# Altium schematic sheet FPGA.SchDoc
size A3; SheetNumber: 1; SheetTotal: 1
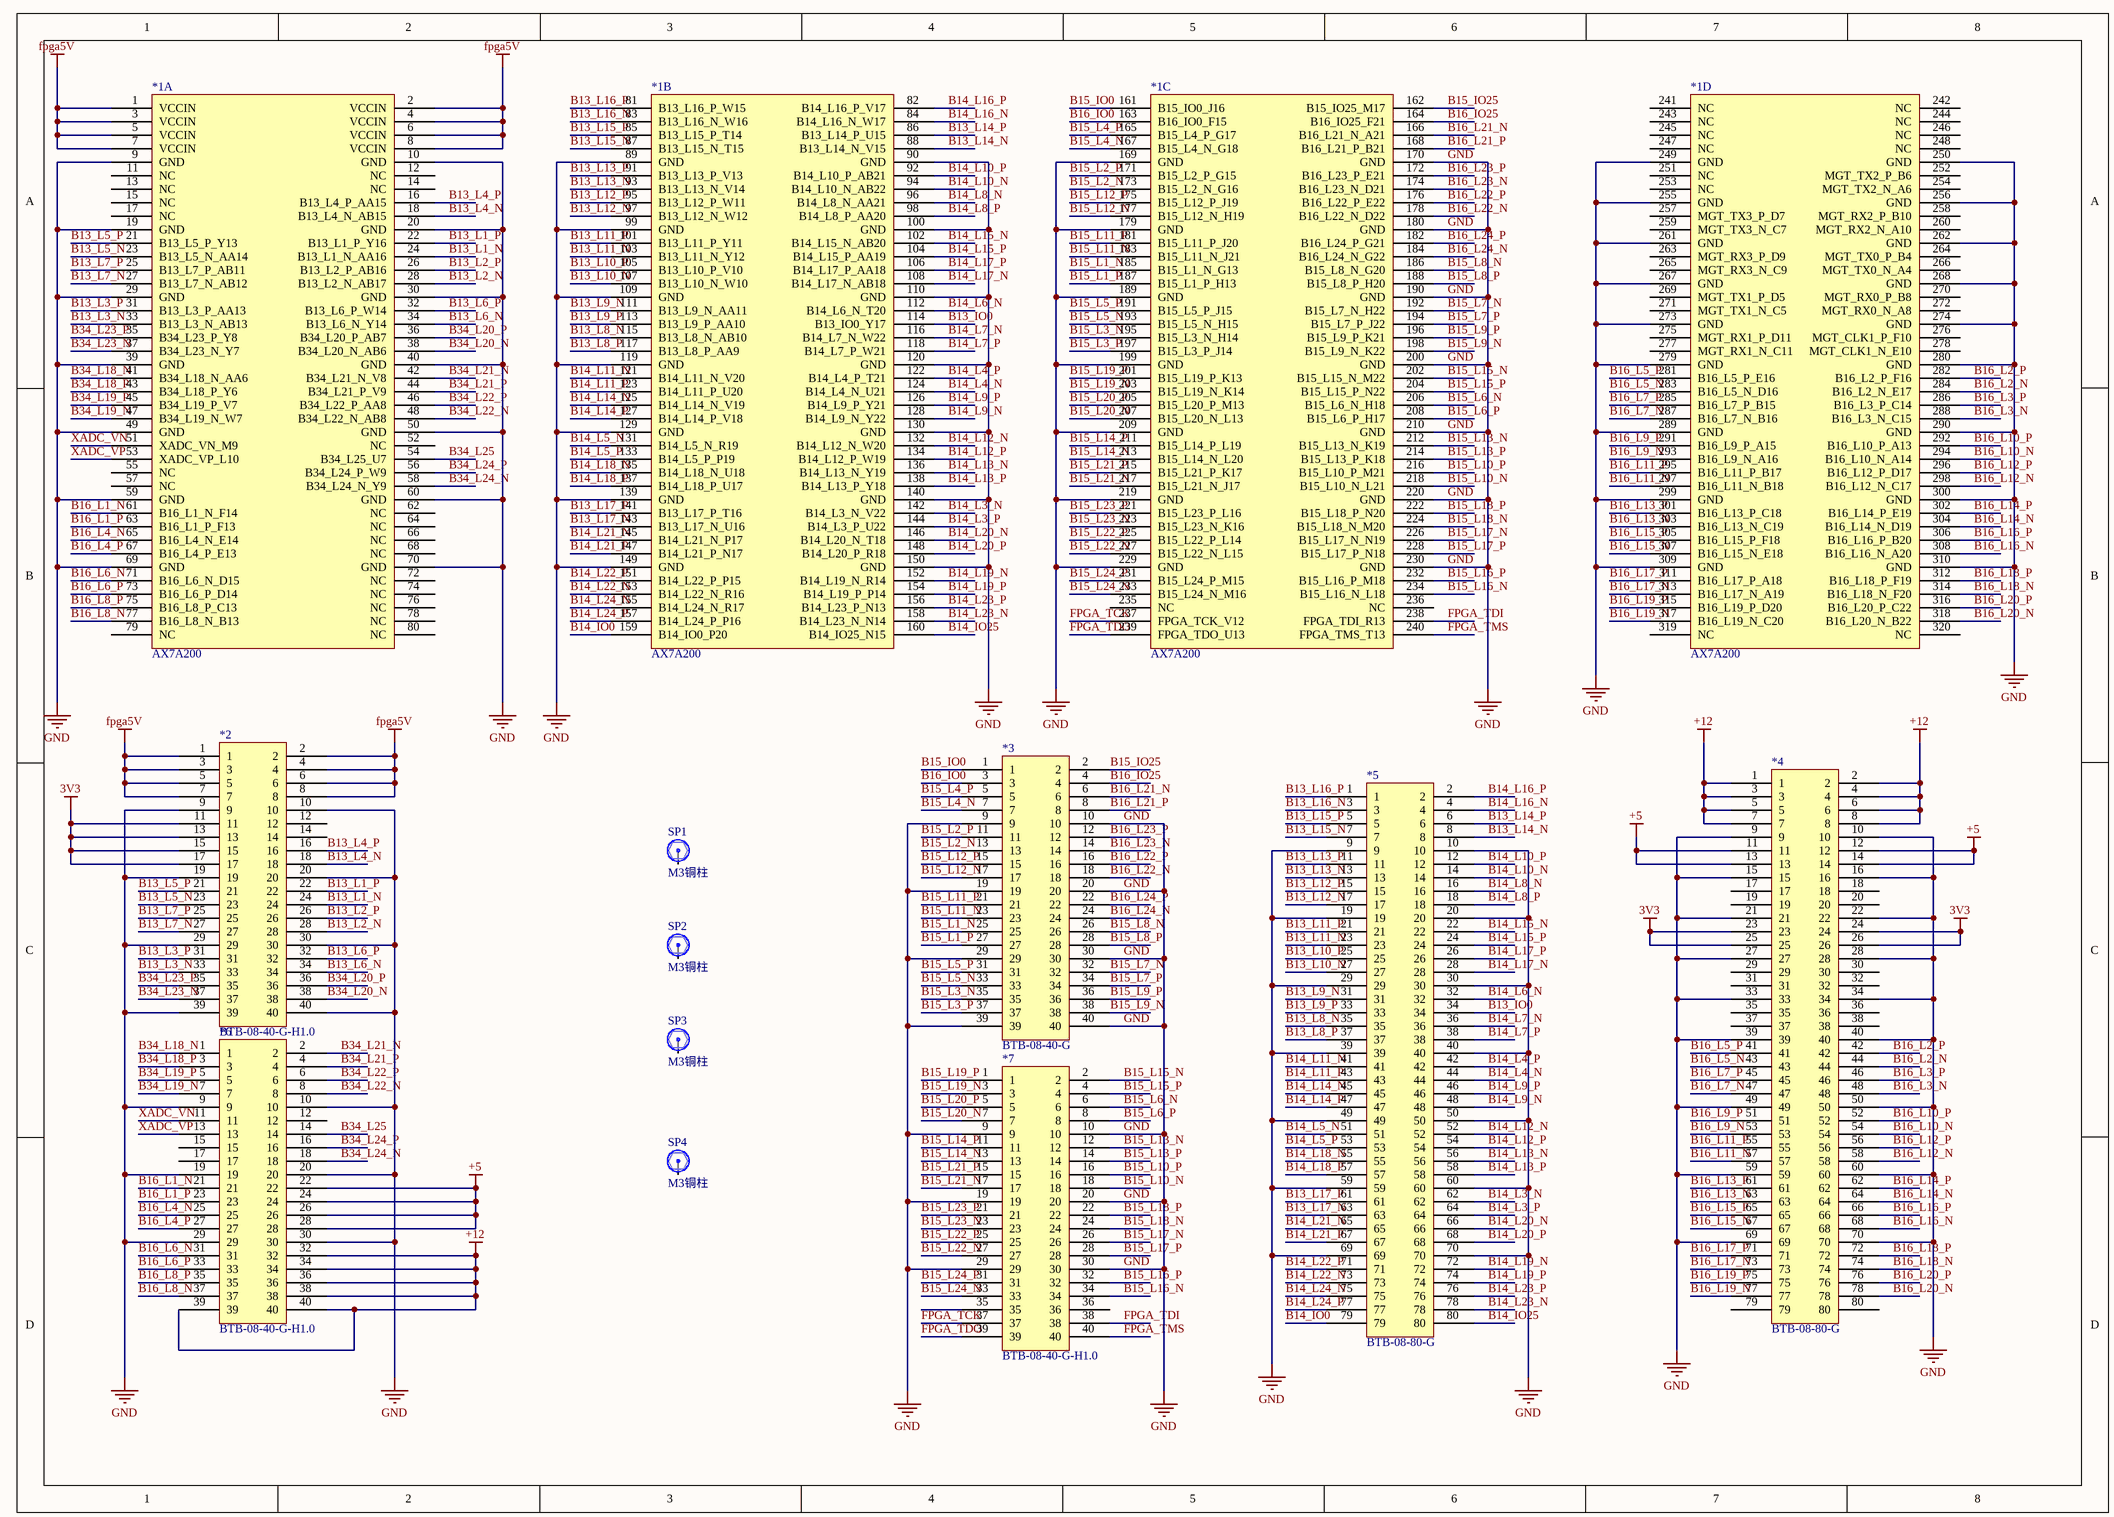
[diagram p0: FPGA.SchDoc]

## Parts
*1  AX7A200  [AX7A200]  (parts A,B,C,D of 4)
*2  BTB-08-40-G-H1.0  [BTB-08-40-G-H1.0]
*3  BTB-08-40-G  [BTB-08-40-G]
*4  BTB-08-80-G  [BTB-08-80-M]
*5  BTB-08-80-G  [BTB-08-80-M]
*6  BTB-08-40-G-H1.0  [BTB-08-40-G-H1.0]
*7  BTB-08-40-G-H1.0  [BTB-08-40-G-H1.0]
SP1  M3铜柱  [M3x10_N]
SP2  M3铜柱  [M3x10_N]
SP3  M3铜柱  [M3x10_N]
SP4  M3铜柱  [M3x10_N]

## Nets
3V3: *2.11 *2.13 *2.15 *2.17 *4.23 *4.24 *4.25 *4.26
+5: *4.11 *4.12 *4.13 *4.14 *6.22 *6.24 *6.26 *6.28
+12: *4.1 *4.2 *4.3 *4.4 *4.5 *4.6 *4.7 *4.8 *6.32 *6.34 *6.36 *6.38 *6.39 *6.40
fpga5V: *1.1(VCCIN) *1.2(VCCIN) *1.3(VCCIN) *1.4(VCCIN) *1.5(VCCIN) *1.6(VCCIN) *1.7(VCCIN) *1.8(VCCIN) *2.1 *2.2 *2.3 *2.4 *2.5 *2.6 *2.7 *2.8
GND: *1.9(GND) *1.10(GND) *1.19(GND) *1.20(GND) *1.29(GND) *1.30(GND) *1.39(GND) *1.40(GND) *1.49(GND) *1.50(GND) *1.59(GND) *1.60(GND) *1.69(GND) *1.70(GND) *1.89(GND) *1.90(GND) *1.99(GND) *1.100(GND) *1.109(GND) *1.110(GND) *1.119(GND) *1.120(GND) *1.129(GND) *1.130(GND) *1.139(GND) *1.140(GND) *1.149(GND) *1.150(GND) *1.169(GND) *1.170(GND) *1.179(GND) *1.180(GND) *1.189(GND) *1.190(GND) *1.199(GND) *1.200(GND) *1.209(GND) *1.210(GND) *1.219(GND) *1.220(GND) *1.229(GND) *1.230(GND) *1.249(GND) *1.250(GND) *1.255(GND) *1.256(GND) *1.261(GND) *1.262(GND) *1.267(GND) *1.268(GND) *1.273(GND) *1.274(GND) *1.279(GND) *1.280(GND) *1.289(GND) *1.290(GND) *1.299(GND) *1.300(GND) *1.309(GND) *1.310(GND) *2.9 *2.10 *2.19 *2.20 *2.29 *2.30 *2.39 *2.40 *3.9 *3.10 *3.19 *3.20 *3.29 *3.30 *3.39 *3.40 *4.9 *4.10 *4.15 *4.16 *4.21 *4.22 *4.27 *4.28 *4.33 *4.34 *4.39 *4.40 *4.49 *4.50 *4.59 *4.60 *4.69 *4.70 *5.9 *5.10 *5.19 *5.20 *5.29 *5.30 *5.39 *5.40 *5.49 *5.50 *5.59 *5.60 *5.69 *5.70 *6.9 *6.10 *6.19 *6.20 *6.29 *6.30 *7.9 *7.10 *7.19 *7.20 *7.29 *7.30
B13_IO0: *1.114(B13_IO0_Y17) *5.34
B13_L1_N: *1.24(B13_L1_N_AA16) *2.24
B13_L1_P: *1.22(B13_L1_P_Y16) *2.22
B13_L2_N: *1.28(B13_L2_N_AB17) *2.28
B13_L2_P: *1.26(B13_L2_P_AB16) *2.26
B13_L3_N: *1.33(B13_L3_N_AB13) *2.33
B13_L3_P: *1.31(B13_L3_P_AA13) *2.31
B13_L4_N: *1.18(B13_L4_N_AB15) *2.18
B13_L4_P: *1.16(B13_L4_P_AA15) *2.16
B13_L5_N: *1.23(B13_L5_N_AA14) *2.23
B13_L5_P: *1.21(B13_L5_P_Y13) *2.21
B13_L6_N: *1.34(B13_L6_N_Y14) *2.34
B13_L6_P: *1.32(B13_L6_P_W14) *2.32
B13_L7_N: *1.27(B13_L7_N_AB12) *2.27
B13_L7_P: *1.25(B13_L7_P_AB11) *2.25
B13_L8_N: *1.115(B13_L8_N_AB10) *5.35
B13_L8_P: *1.117(B13_L8_P_AA9) *5.37
B13_L9_N: *1.111(B13_L9_N_AA11) *5.31
B13_L9_P: *1.113(B13_L9_P_AA10) *5.33
B13_L10_N: *1.107(B13_L10_N_W10) *5.27
B13_L10_P: *1.105(B13_L10_P_V10) *5.25
B13_L11_N: *1.103(B13_L11_N_Y12) *5.23
B13_L11_P: *1.101(B13_L11_P_Y11) *5.21
B13_L12_N: *1.97(B13_L12_N_W12) *5.17
B13_L12_P: *1.95(B13_L12_P_W11) *5.15
B13_L13_N: *1.93(B13_L13_N_V14) *5.13
B13_L13_P: *1.91(B13_L13_P_V13) *5.11
B13_L14_N: *1.88(B13_L14_N_V15) *5.8
B13_L14_P: *1.86(B13_L14_P_U15) *5.6
B13_L15_N: *1.87(B13_L15_N_T15) *5.7
B13_L15_P: *1.85(B13_L15_P_T14) *5.5
B13_L16_N: *1.83(B13_L16_N_W16) *5.3
B13_L16_P: *1.81(B13_L16_P_W15) *5.1
B13_L17_N: *1.143(B13_L17_N_U16) *5.63
B13_L17_P: *1.141(B13_L17_P_T16) *5.61
B14_IO0: *1.159(B14_IO0_P20) *5.79
B14_IO25: *1.160(B14_IO25_N15) *5.80
B14_L3_N: *1.142(B14_L3_N_V22) *5.62
B14_L3_P: *1.144(B14_L3_P_U22) *5.64
B14_L4_N: *1.124(B14_L4_N_U21) *5.44
B14_L4_P: *1.122(B14_L4_P_T21) *5.42
B14_L5_N: *1.131(B14_L5_N_R19) *5.51
B14_L5_P: *1.133(B14_L5_P_P19) *5.53
B14_L6_N: *1.112(B14_L6_N_T20) *5.32
B14_L7_N: *1.116(B14_L7_N_W22) *5.36
B14_L7_P: *1.118(B14_L7_P_W21) *5.38
B14_L8_N: *1.96(B14_L8_N_AA21) *5.16
B14_L8_P: *1.98(B14_L8_P_AA20) *5.18
B14_L9_N: *1.128(B14_L9_N_Y22) *5.48
B14_L9_P: *1.126(B14_L9_P_Y21) *5.46
B14_L10_N: *1.94(B14_L10_N_AB22) *5.14
B14_L10_P: *1.92(B14_L10_P_AB21) *5.12
B14_L11_N: *1.121(B14_L11_N_V20) *5.41
B14_L11_P: *1.123(B14_L11_P_U20) *5.43
B14_L12_N: *1.132(B14_L12_N_W20) *5.52
B14_L12_P: *1.134(B14_L12_P_W19) *5.54
B14_L13_N: *1.136(B14_L13_N_Y19) *5.56
B14_L13_P: *1.138(B14_L13_P_Y18) *5.58
B14_L14_N: *1.125(B14_L14_N_V19) *5.45
B14_L14_P: *1.127(B14_L14_P_V18) *5.47
B14_L15_N: *1.102(B14_L15_N_AB20) *5.22
B14_L15_P: *1.104(B14_L15_P_AA19) *5.24
B14_L16_N: *1.84(B14_L16_N_W17) *5.4
B14_L16_P: *1.82(B14_L16_P_V17) *5.2
B14_L17_N: *1.108(B14_L17_N_AB18) *5.28
B14_L17_P: *1.106(B14_L17_P_AA18) *5.26
B14_L18_N: *1.135(B14_L18_N_U18) *5.55
B14_L18_P: *1.137(B14_L18_P_U17) *5.57
B14_L19_N: *1.152(B14_L19_N_R14) *5.72
B14_L19_P: *1.154(B14_L19_P_P14) *5.74
B14_L20_N: *1.146(B14_L20_N_T18) *5.66
B14_L20_P: *1.148(B14_L20_P_R18) *5.68
B14_L21_N: *1.145(B14_L21_N_P17) *5.65
B14_L21_P: *1.147(B14_L21_P_N17) *5.67
B14_L22_N: *1.153(B14_L22_N_R16) *5.73
B14_L22_P: *1.151(B14_L22_P_P15) *5.71
B14_L23_N: *1.158(B14_L23_N_N14) *5.78
B14_L23_P: *1.156(B14_L23_P_N13) *5.76
B14_L24_N: *1.155(B14_L24_N_R17) *5.75
B14_L24_P: *1.157(B14_L24_P_P16) *5.77
B15_IO0: *1.161(B15_IO0_J16) *3.1
B15_IO25: *1.162(B15_IO25_M17) *3.2
B15_L1_N: *1.185(B15_L1_N_G13) *3.25
B15_L1_P: *1.187(B15_L1_P_H13) *3.27
B15_L2_N: *1.173(B15_L2_N_G16) *3.13
B15_L2_P: *1.171(B15_L2_P_G15) *3.11
B15_L3_N: *1.195(B15_L3_N_H14) *3.35
B15_L3_P: *1.197(B15_L3_P_J14) *3.37
B15_L4_N: *1.167(B15_L4_N_G18) *3.7
B15_L4_P: *1.165(B15_L4_P_G17) *3.5
B15_L5_N: *1.193(B15_L5_N_H15) *3.33
B15_L5_P: *1.191(B15_L5_P_J15) *3.31
B15_L6_N: *1.206(B15_L6_N_H18) *7.6
B15_L6_P: *1.208(B15_L6_P_H17) *7.8
B15_L7_N: *1.192(B15_L7_N_H22) *3.32
B15_L7_P: *1.194(B15_L7_P_J22) *3.34
B15_L8_N: *1.186(B15_L8_N_G20) *3.26
B15_L8_P: *1.188(B15_L8_P_H20) *3.28
B15_L9_N: *1.198(B15_L9_N_K22) *3.38
B15_L9_P: *1.196(B15_L9_P_K21) *3.36
B15_L10_N: *1.218(B15_L10_N_L21) *7.18
B15_L10_P: *1.216(B15_L10_P_M21) *7.16
B15_L11_N: *1.183(B15_L11_N_J21) *3.23
B15_L11_P: *1.181(B15_L11_P_J20) *3.21
B15_L12_N: *1.177(B15_L12_N_H19) *3.17
B15_L12_P: *1.175(B15_L12_P_J19) *3.15
B15_L13_N: *1.212(B15_L13_N_K19) *7.12
B15_L13_P: *1.214(B15_L13_P_K18) *7.14
B15_L14_N: *1.213(B15_L14_N_L20) *7.13
B15_L14_P: *1.211(B15_L14_P_L19) *7.11
B15_L15_N: *1.202(B15_L15_N_M22) *7.2
B15_L15_P: *1.204(B15_L15_P_N22) *7.4
B15_L16_N: *1.234(B15_L16_N_L18) *7.34
B15_L16_P: *1.232(B15_L16_P_M18) *7.32
B15_L17_N: *1.226(B15_L17_N_N19) *7.26
B15_L17_P: *1.228(B15_L17_P_N18) *7.28
B15_L18_N: *1.224(B15_L18_N_M20) *7.24
B15_L18_P: *1.222(B15_L18_P_N20) *7.22
B15_L19_N: *1.203(B15_L19_N_K14) *7.3
B15_L19_P: *1.201(B15_L19_P_K13) *7.1
B15_L20_N: *1.207(B15_L20_N_L13) *7.7
B15_L20_P: *1.205(B15_L20_P_M13) *7.5
B15_L21_N: *1.217(B15_L21_N_J17) *7.17
B15_L21_P: *1.215(B15_L21_P_K17) *7.15
B15_L22_N: *1.227(B15_L22_N_L15) *7.27
B15_L22_P: *1.225(B15_L22_P_L14) *7.25
B15_L23_N: *1.223(B15_L23_N_K16) *7.23
B15_L23_P: *1.221(B15_L23_P_L16) *7.21
B15_L24_N: *1.233(B15_L24_N_M16) *7.33
B15_L24_P: *1.231(B15_L24_P_M15) *7.31
B16_IO0: *1.163(B16_IO0_F15) *3.3
B16_IO25: *1.164(B16_IO25_F21) *3.4
B16_L1_N: *1.61(B16_L1_N_F14) *6.21
B16_L1_P: *1.63(B16_L1_P_F13) *6.23
B16_L2_N: *1.284(B16_L2_N_E17) *4.44
B16_L2_P: *1.282(B16_L2_P_F16) *4.42
B16_L3_N: *1.288(B16_L3_N_C15) *4.48
B16_L3_P: *1.286(B16_L3_P_C14) *4.46
B16_L4_N: *1.65(B16_L4_N_E14) *6.25
B16_L4_P: *1.67(B16_L4_P_E13) *6.27
B16_L5_N: *1.283(B16_L5_N_D16) *4.43
B16_L5_P: *1.281(B16_L5_P_E16) *4.41
B16_L6_N: *1.71(B16_L6_N_D15) *6.31
B16_L6_P: *1.73(B16_L6_P_D14) *6.33
B16_L7_N: *1.287(B16_L7_N_B16) *4.47
B16_L7_P: *1.285(B16_L7_P_B15) *4.45
B16_L8_N: *1.77(B16_L8_N_B13) *6.37
B16_L8_P: *1.75(B16_L8_P_C13) *6.35
B16_L9_N: *1.293(B16_L9_N_A16) *4.53
B16_L9_P: *1.291(B16_L9_P_A15) *4.51
B16_L10_N: *1.294(B16_L10_N_A14) *4.54
B16_L10_P: *1.292(B16_L10_P_A13) *4.52
B16_L11_N: *1.297(B16_L11_N_B18) *4.57
B16_L11_P: *1.295(B16_L11_P_B17) *4.55
B16_L12_N: *1.298(B16_L12_N_C17) *4.58
B16_L12_P: *1.296(B16_L12_P_D17) *4.56
B16_L13_N: *1.303(B16_L13_N_C19) *4.63
B16_L13_P: *1.301(B16_L13_P_C18) *4.61
B16_L14_N: *1.304(B16_L14_N_D19) *4.64
B16_L14_P: *1.302(B16_L14_P_E19) *4.62
B16_L15_N: *1.307(B16_L15_N_E18) *4.67
B16_L15_P: *1.305(B16_L15_P_F18) *4.65
B16_L16_N: *1.308(B16_L16_N_A20) *4.68
B16_L16_P: *1.306(B16_L16_P_B20) *4.66
B16_L17_N: *1.313(B16_L17_N_A19) *4.73
B16_L17_P: *1.311(B16_L17_P_A18) *4.71
B16_L18_N: *1.314(B16_L18_N_F20) *4.74
B16_L18_P: *1.312(B16_L18_P_F19) *4.72
B16_L19_N: *1.317(B16_L19_N_C20) *4.77
B16_L19_P: *1.315(B16_L19_P_D20) *4.75
B16_L20_N: *1.318(B16_L20_N_B22) *4.78
B16_L20_P: *1.316(B16_L20_P_C22) *4.76
B16_L21_N: *1.166(B16_L21_N_A21) *3.6
B16_L21_P: *1.168(B16_L21_P_B21) *3.8
B16_L22_N: *1.178(B16_L22_N_D22) *3.18
B16_L22_P: *1.176(B16_L22_P_E22) *3.16
B16_L23_N: *1.174(B16_L23_N_D21) *3.14
B16_L23_P: *1.172(B16_L23_P_E21) *3.12
B16_L24_N: *1.184(B16_L24_N_G22) *3.24
B16_L24_P: *1.182(B16_L24_P_G21) *3.22
B34_L18_N: *1.41(B34_L18_N_AA6) *6.1
B34_L18_P: *1.43(B34_L18_P_Y6) *6.3
B34_L19_N: *1.47(B34_L19_N_W7) *6.7
B34_L19_P: *1.45(B34_L19_P_V7) *6.5
B34_L20_N: *1.38(B34_L20_N_AB6) *2.38
B34_L20_P: *1.36(B34_L20_P_AB7) *2.36
B34_L21_N: *1.42(B34_L21_N_V8) *6.2
B34_L21_P: *1.44(B34_L21_P_V9) *6.4
B34_L22_N: *1.48(B34_L22_N_AB8) *6.8
B34_L22_P: *1.46(B34_L22_P_AA8) *6.6
B34_L23_N: *1.37(B34_L23_N_Y7) *2.37
B34_L23_P: *1.35(B34_L23_P_Y8) *2.35
B34_L24_N: *1.58(B34_L24_N_Y9) *6.18
B34_L24_P: *1.56(B34_L24_P_W9) *6.16
B34_L25: *1.54(B34_L25_U7) *6.14
FPGA_TCK: *1.237(FPGA_TCK_V12) *7.37
FPGA_TDI: *1.238(FPGA_TDI_R13) *7.38
FPGA_TDO: *1.239(FPGA_TDO_U13) *7.39
FPGA_TMS: *1.240(FPGA_TMS_T13) *7.40
XADC_VN: *1.51(XADC_VN_M9) *6.11
XADC_VP: *1.53(XADC_VP_L10) *6.13

Not connected (* = marked no-connect by the designer): *1 11(NC) 12(NC) 13(NC) 14(NC) 15(NC) 17(NC) 52(NC) 55(NC) 57(NC) 62(NC) 64(NC) 66(NC) 68(NC) 72(NC) 74(NC) 76(NC) 78(NC) 79(NC) 80(NC) 235(NC) 236(NC) 241(NC) 242(NC) 243(NC) 244(NC) 245(NC) 246(NC) 247(NC) 248(NC) 251(NC) 252(MGT_TX2_P_B6) 253(NC) 254(MGT_TX2_N_A6) 257(MGT_TX3_P_D7) 258(MGT_RX2_P_B10) 259(MGT_TX3_N_C7) 260(MGT_RX2_N_A10) 263(MGT_RX3_P_D9) 264(MGT_TX0_P_B4) 265(MGT_RX3_N_C9) 266(MGT_TX0_N_A4) 269(MGT_TX1_P_D5) 270(MGT_RX0_P_B8) 271(MGT_TX1_N_C5) 272(MGT_RX0_N_A8) 275(MGT_RX1_P_D11) 276(MGT_CLK1_P_F10) 277(MGT_RX1_N_C11) 278(MGT_CLK1_N_E10) 319(NC) 320(NC); *2 12 14; *4 17 18 19 20 29 30 31 32 35 36 37 38 79 80; *6 12 15 17; *7 35 36; SP1 1; SP2 1; SP3 1; SP4 1

## Library data of the parts
SP1-SP4 = 铜柱大焊盘: 铜柱; 版权归属: 封装库来自淘宝 ID：黄晶宝石; BOM名称: 铜柱; 学习资源: https://shop463601444.taobao.com